# Altium schematic sheet 08_INPUTCAPTURE_ENCODER.SchDoc
size 420 x 297 mm; SheetNumber: 8; SheetTotal: 12
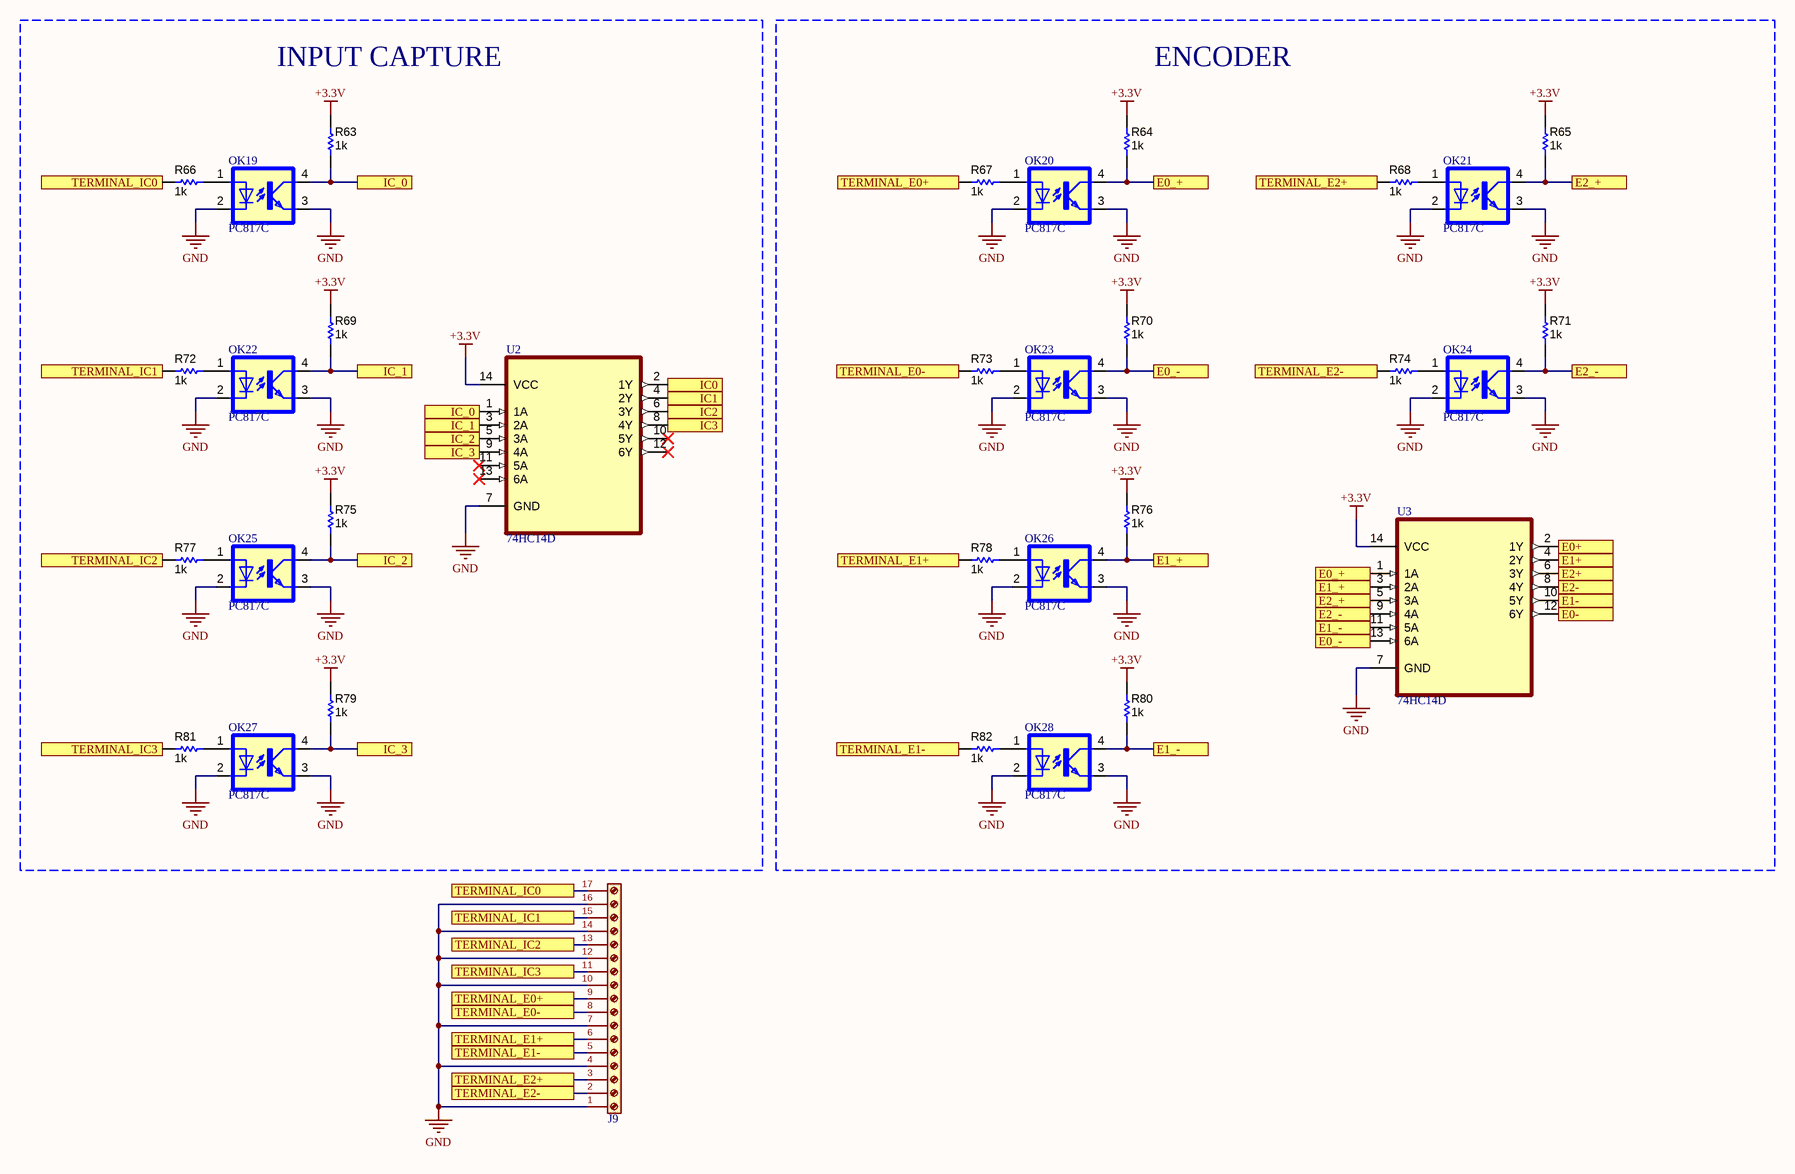
[diagram p0: 08_INPUTCAPTURE_ENCODER.SchDoc]

## Parts
J9  Terminal_01x17_P5.00  [TerminalBlock_Phoenix_PT-1,5-17-5.0-H_1x17_P5.00mm_Horizontal]  (value not drawn)
OK19  PC817C  [SOP254P975X460-4N]
OK20  PC817C  [SOP254P975X460-4N]
OK21  PC817C  [SOP254P975X460-4N]
OK22  PC817C  [SOP254P975X460-4N]
OK23  PC817C  [SOP254P975X460-4N]
OK24  PC817C  [SOP254P975X460-4N]
OK25  PC817C  [SOP254P975X460-4N]
OK26  PC817C  [SOP254P975X460-4N]
OK27  PC817C  [SOP254P975X460-4N]
OK28  PC817C  [SOP254P975X460-4N]
R63  ValueDisplayed: 1k  [0603]  (hidden comment: MCT06030Z0000ZP500)
R64  ValueDisplayed: 1k  [0603]  (hidden comment: MCT06030Z0000ZP500)
R65  ValueDisplayed: 1k  [0603]  (hidden comment: MCT06030Z0000ZP500)
R66  ValueDisplayed: 1k  [0603]  (hidden comment: MCT06030Z0000ZP500)
R67  ValueDisplayed: 1k  [0603]  (hidden comment: MCT06030Z0000ZP500)
R68  ValueDisplayed: 1k  [0603]  (hidden comment: MCT06030Z0000ZP500)
R69  ValueDisplayed: 1k  [0603]  (hidden comment: MCT06030Z0000ZP500)
R70  ValueDisplayed: 1k  [0603]  (hidden comment: MCT06030Z0000ZP500)
R71  ValueDisplayed: 1k  [0603]  (hidden comment: MCT06030Z0000ZP500)
R72  ValueDisplayed: 1k  [0603]  (hidden comment: MCT06030Z0000ZP500)
R73  ValueDisplayed: 1k  [0603]  (hidden comment: MCT06030Z0000ZP500)
R74  ValueDisplayed: 1k  [0603]  (hidden comment: MCT06030Z0000ZP500)
R75  ValueDisplayed: 1k  [0603]  (hidden comment: MCT06030Z0000ZP500)
R76  ValueDisplayed: 1k  [0603]  (hidden comment: MCT06030Z0000ZP500)
R77  ValueDisplayed: 1k  [0603]  (hidden comment: MCT06030Z0000ZP500)
R78  ValueDisplayed: 1k  [0603]  (hidden comment: MCT06030Z0000ZP500)
R79  ValueDisplayed: 1k  [0603]  (hidden comment: MCT06030Z0000ZP500)
R80  ValueDisplayed: 1k  [0603]  (hidden comment: MCT06030Z0000ZP500)
R81  ValueDisplayed: 1k  [0603]  (hidden comment: MCT06030Z0000ZP500)
R82  ValueDisplayed: 1k  [0603]  (hidden comment: MCT06030Z0000ZP500)
U2  74HC14D  [SOIC127P600X175-14N]
U3  74HC14D  [SOIC127P600X175-14N]

## Blocks framed on the sheet
INPUT CAPTURE: OK19 OK22 OK25 OK27 R63 R66 R69 R72 R75 R77 R79 R81 U2
ENCODER: OK20 OK21 OK23 OK24 OK26 OK28 R64 R65 R67 R68 R70 R71 R73 R74 R76 R78 R80 R82 U3

## Ports
E0+ (see 04_STM32F303VCT6[3C]), E0- (see 04_STM32F303VCT6[3B]), E0_+ (see 08_INPUTCAPTURE_ENCODER[4A]), E0_+ (see 08_INPUTCAPTURE_ENCODER[4B]), E0_- (see 08_INPUTCAPTURE_ENCODER[4B]), E1+ (see 04_STM32F303VCT6[5B]), E1- (see 04_STM32F303VCT6[5B]), E1_+ (see 08_INPUTCAPTURE_ENCODER[4B]), E1_- (see 08_INPUTCAPTURE_ENCODER[4B]), E2+ (see 04_STM32F303VCT6[5B]), E2- (see 04_STM32F303VCT6[5B]), E2_+ (see 08_INPUTCAPTURE_ENCODER[4B]), E2_+ (see 08_INPUTCAPTURE_ENCODER[5A]), E2_- (see 08_INPUTCAPTURE_ENCODER[4B]), E2_- (see 08_INPUTCAPTURE_ENCODER[5B]), IC0 (see 04_STM32F303VCT6[3C]), IC1 (see 04_STM32F303VCT6[3C]), IC2 (see 04_STM32F303VCT6[3B]), IC3 (see 04_STM32F303VCT6[3B]), IC_0 (see 08_INPUTCAPTURE_ENCODER[2A]), IC_0 (see 08_INPUTCAPTURE_ENCODER[2B]), IC_1 (see 08_INPUTCAPTURE_ENCODER[2B]), IC_2 (see 08_INPUTCAPTURE_ENCODER[2B]), IC_3 (see 08_INPUTCAPTURE_ENCODER[2B]), TERMINAL_E0+ (see 08_INPUTCAPTURE_ENCODER[2C]), TERMINAL_E0+ (see 08_INPUTCAPTURE_ENCODER[3A]), TERMINAL_E0- (see 08_INPUTCAPTURE_ENCODER[2C]), TERMINAL_E0- (see 08_INPUTCAPTURE_ENCODER[3B]), TERMINAL_E1+ (see 08_INPUTCAPTURE_ENCODER[2C]), TERMINAL_E1+ (see 08_INPUTCAPTURE_ENCODER[3B]), TERMINAL_E1- (see 08_INPUTCAPTURE_ENCODER[2C]), TERMINAL_E1- (see 08_INPUTCAPTURE_ENCODER[3B]), TERMINAL_E2+ (see 08_INPUTCAPTURE_ENCODER[2C]), TERMINAL_E2+ (see 08_INPUTCAPTURE_ENCODER[4A]), TERMINAL_E2- (see 08_INPUTCAPTURE_ENCODER[2C]), TERMINAL_E2- (see 08_INPUTCAPTURE_ENCODER[4B]), TERMINAL_IC0 (see 08_INPUTCAPTURE_ENCODER[1A]), TERMINAL_IC0 (see 08_INPUTCAPTURE_ENCODER[2C]), TERMINAL_IC1 (see 08_INPUTCAPTURE_ENCODER[1B]), TERMINAL_IC1 (see 08_INPUTCAPTURE_ENCODER[2C]), TERMINAL_IC2 (see 08_INPUTCAPTURE_ENCODER[1B]), TERMINAL_IC2 (see 08_INPUTCAPTURE_ENCODER[2C]), TERMINAL_IC3 (see 08_INPUTCAPTURE_ENCODER[1B]), TERMINAL_IC3 (see 08_INPUTCAPTURE_ENCODER[2C])

## Nets
+3.3V: R63.2 R64.2 R65.2 R69.2 R70.2 R71.2 R75.2 R76.2 R79.2 R80.2 U2.14(VCC) U3.14(VCC)
GND: J9.1(Pin_1) J9.4(Pin_4) J9.7(Pin_7) J9.10(Pin_10) J9.12(Pin_12) J9.14(Pin_14) J9.16(Pin_16) OK19.2(C) OK19.3(EMIT) OK20.2(C) OK20.3(EMIT) OK21.2(C) OK21.3(EMIT) OK22.2(C) OK22.3(EMIT) OK23.2(C) OK23.3(EMIT) OK24.2(C) OK24.3(EMIT) OK25.2(C) OK25.3(EMIT) OK26.2(C) OK26.3(EMIT) OK27.2(C) OK27.3(EMIT) OK28.2(C) OK28.3(EMIT) U2.7(GND) U3.7(GND)
E0+: U3.2(1Y) ; port E0+
E0-: U3.12(6Y) ; port E0-
E0_+: OK20.4(COL) R64.1 U3.1(1A) ; port E0_+
E0_-: OK23.4(COL) R70.1 U3.13(6A) ; port E0_-
E1+: U3.4(2Y) ; port E1+
E1-: U3.10(5Y) ; port E1-
E1_+: OK26.4(COL) R76.1 U3.3(2A) ; port E1_+
E1_-: OK28.4(COL) R80.1 U3.11(5A) ; port E1_-
E2+: U3.6(3Y) ; port E2+
E2-: U3.8(4Y) ; port E2-
E2_+: OK21.4(COL) R65.1 U3.5(3A) ; port E2_+
E2_-: OK24.4(COL) R71.1 U3.9(4A) ; port E2_-
IC0: U2.2(1Y) ; port IC0
IC1: U2.4(2Y) ; port IC1
IC2: U2.6(3Y) ; port IC2
IC3: U2.8(4Y) ; port IC3
IC_0: OK19.4(COL) R63.1 U2.1(1A) ; port IC_0
IC_1: OK22.4(COL) R69.1 U2.3(2A) ; port IC_1
IC_2: OK25.4(COL) R75.1 U2.5(3A) ; port IC_2
IC_3: OK27.4(COL) R79.1 U2.9(4A) ; port IC_3
TERMINAL_E0+: J9.9(Pin_9) R67.1 ; port TERMINAL_E0+
TERMINAL_E0-: J9.8(Pin_8) R73.1 ; port TERMINAL_E0-
TERMINAL_E1+: J9.6(Pin_6) R78.1 ; port TERMINAL_E1+
TERMINAL_E1-: J9.5(Pin_5) R82.1 ; port TERMINAL_E1-
TERMINAL_E2+: J9.3(Pin_3) R68.1 ; port TERMINAL_E2+
TERMINAL_E2-: J9.2(Pin_2) R74.1 ; port TERMINAL_E2-
TERMINAL_IC0: J9.17(Pin_17) R66.1 ; port TERMINAL_IC0
TERMINAL_IC1: J9.15(Pin_15) R72.1 ; port TERMINAL_IC1
TERMINAL_IC2: J9.13(Pin_13) R77.1 ; port TERMINAL_IC2
TERMINAL_IC3: J9.11(Pin_11) R81.1 ; port TERMINAL_IC3
NetOK19_1: OK19.1(A) R66.2
NetOK20_1: OK20.1(A) R67.2
NetOK21_1: OK21.1(A) R68.2
NetOK22_1: OK22.1(A) R72.2
NetOK23_1: OK23.1(A) R73.2
NetOK24_1: OK24.1(A) R74.2
NetOK25_1: OK25.1(A) R77.2
NetOK26_1: OK26.1(A) R78.2
NetOK27_1: OK27.1(A) R81.2
NetOK28_1: OK28.1(A) R82.2

Not connected (* = marked no-connect by the designer): U2 10(5Y)* 11(5A)* 12(6Y)* 13(6A)*

## Notes on the sheet
- Sub-system:
- Project:
- Design by:
- Sheet title:
- Sheet
- of
- Checked by:
- Approved by:
- Doc No:
- Revision:
- Size:
- Date:
- A3

## Library data of the parts
OK19-OK28 = PC817C: RF Mixer IC Cellular, DCS, PCS, W-CDMA, WLAN Up Converter 50MHz ~ 400MHz 6-SuperMiniMold; MF: Renesas Electronics America Inc; MP: PC817; SnapEDA_Link: https://www.snapeda.com/parts/PC817/Renesas/view-part/?ref=snap; Package: None; Value: *; Check_prices: https://www.snapeda.com/parts/PC817/Renesas/view-part/?ref=eda
R63-R82 = RES 0R 0603: RES, 0, 5%, 0.125 W, 0603; Manufacturer: Vishay/Beyschlag; Power_W: 125mW; TempCo: ppm/C; Value_Code: 0000; U/M: EA; Value: 0; EIA_Code: E24; SizeX_mm: 1.6; SizeY_mm: 0.8; SizeZ_mm: 1; Value2: 0.125W; SizeArea_mm2: 1.28; CompType: Resistor; AEC Qualified: N; AEC Category: Q200; Supplier Part Number 2: 96Y9454; Publisher: Texas Instruments; Supplier 2: Newark; Supplier Part Number 3: 594-MCT06030Z0000ZP5; Supplier 3: Mouser; Published: 2008-06-26; RoHS: Y; Value1: 5%; MountType: SMT; Supplier 1: Digi-Key; PackageReference: 0603; Tolerance_%: 5%; Res_ohm: 0; LatestRevisionDate: 2017-03-09; PartNumber: MCT06030Z0000ZP500; ComponentLink1Description: Datasheet link; AEC Grade: N/A; Supplier Part Number 1: MCT0603-0.0-ZZCT-ND; Technology: Thin Film; ComponentLink1URL: http://www.vishay.com/docs/28705/mcx0x0xpro.pdf
U2 U3 = 74HC14D: Inverter IC 6 Channel Schmitt Trigger 14-SOIC; MF: Toshiba; SnapEDA_Link: https://www.snapeda.com/parts/74HC14D/Toshiba/view-part/?ref=snap; Package: SO14-14 Nexperia USA Inc.; Value: *; MP: 74HC14D; Check_prices: https://www.snapeda.com/parts/74HC14D/Toshiba/view-part/?ref=eda